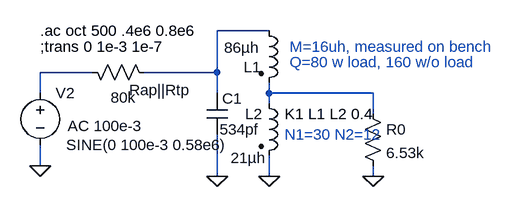
[diagram p0: schematic 9-08-QEX-Anderson-Fig-6.asc]
9-08-QEX-Anderson-Fig-6.asc, the LTspice schematic file:
Version 4
SHEET 1 880 680
WIRE -1696 -448 -1776 -448
WIRE -1968 -384 -2048 -384
WIRE -1776 -384 -1776 -448
WIRE -1776 -384 -1888 -384
WIRE -2048 -352 -2048 -384
WIRE -1776 -352 -1776 -384
WIRE -1696 -352 -1696 -368
WIRE -1536 -352 -1696 -352
WIRE -1696 -336 -1696 -352
WIRE -1536 -320 -1536 -352
WIRE -2048 -240 -2048 -272
WIRE -1776 -224 -1776 -288
WIRE -1696 -224 -1696 -256
WIRE -1536 -224 -1536 -240
FLAG -1536 -224 0
FLAG -1696 -224 0
FLAG -1776 -224 0
FLAG -2048 -240 0
SYMBOL res -1552 -336 R0
SYMATTR InstName R0
SYMATTR Value 6.53k
SYMBOL ind2 -1712 -464 R0
WINDOW 3 -53 42 Left 0
WINDOW 0 -23 72 Left 0
SYMATTR Value 86µh
SYMATTR InstName L1
SYMATTR SpiceLine Rser=
SYMATTR Type ind
SYMBOL cap -1792 -352 R0
WINDOW 3 20 56 Left 0
SYMATTR Value 534pf
SYMATTR InstName C1
SYMBOL res -1872 -368 M270
WINDOW 0 -27 -8 VTop 0
WINDOW 3 -7 48 VBottom 0
SYMATTR InstName Rap||Rtp
SYMATTR Value 80k
SYMBOL voltage -2048 -368 R0
WINDOW 123 42 67 Left 0
WINDOW 39 0 0 Left 0
WINDOW 3 40 96 Left 0
SYMATTR Value2 AC 100e-3
SYMATTR Value SINE(0 100e-3 0.58e6)
SYMATTR InstName V2
SYMBOL ind2 -1712 -352 R0
WINDOW 3 -43 100 Left 0
WINDOW 0 -21 32 Left 0
SYMATTR Value 21µh
SYMATTR InstName L2
SYMATTR Type ind
TEXT -1672 -320 Left 0 !K1 L1 L2 0.4
TEXT -1672 -288 Left 0 ;N1=30 N2=12
TEXT -1664 -424 Left 0 ;M=16uh, measured on bench
TEXT -1664 -400 Left 0 ;Q=80 w load, 160 w/o load
TEXT -2048 -448 Left 0 !.ac oct 500 .4e6 0.8e6
TEXT -2048 -424 Left 0 !;trans 0 1e-3 1e-7

The netlist it stands for:
* 9-08-QEX-Anderson-Fig-6.asc
R0 N003 0 6.53k
L1 N001 N003 86µh Rser=
C1 N001 0 534pf
Rap||Rtp N001 N002 80k
V2 N002 0 SINE(0 100e-3 0.58e6) AC 100e-3
L2 N003 0 21µh
K1 L1 L2 0.4
* N1=30 N2=12
* M=16uh, measured on bench
* Q=80 w load, 160 w/o load
.ac oct 500 .4e6 0.8e6
;trans 0 1e-3 1e-7
.backanno
.end